# EasyEDA Pro project 通用采样.eprj, board CKSR15
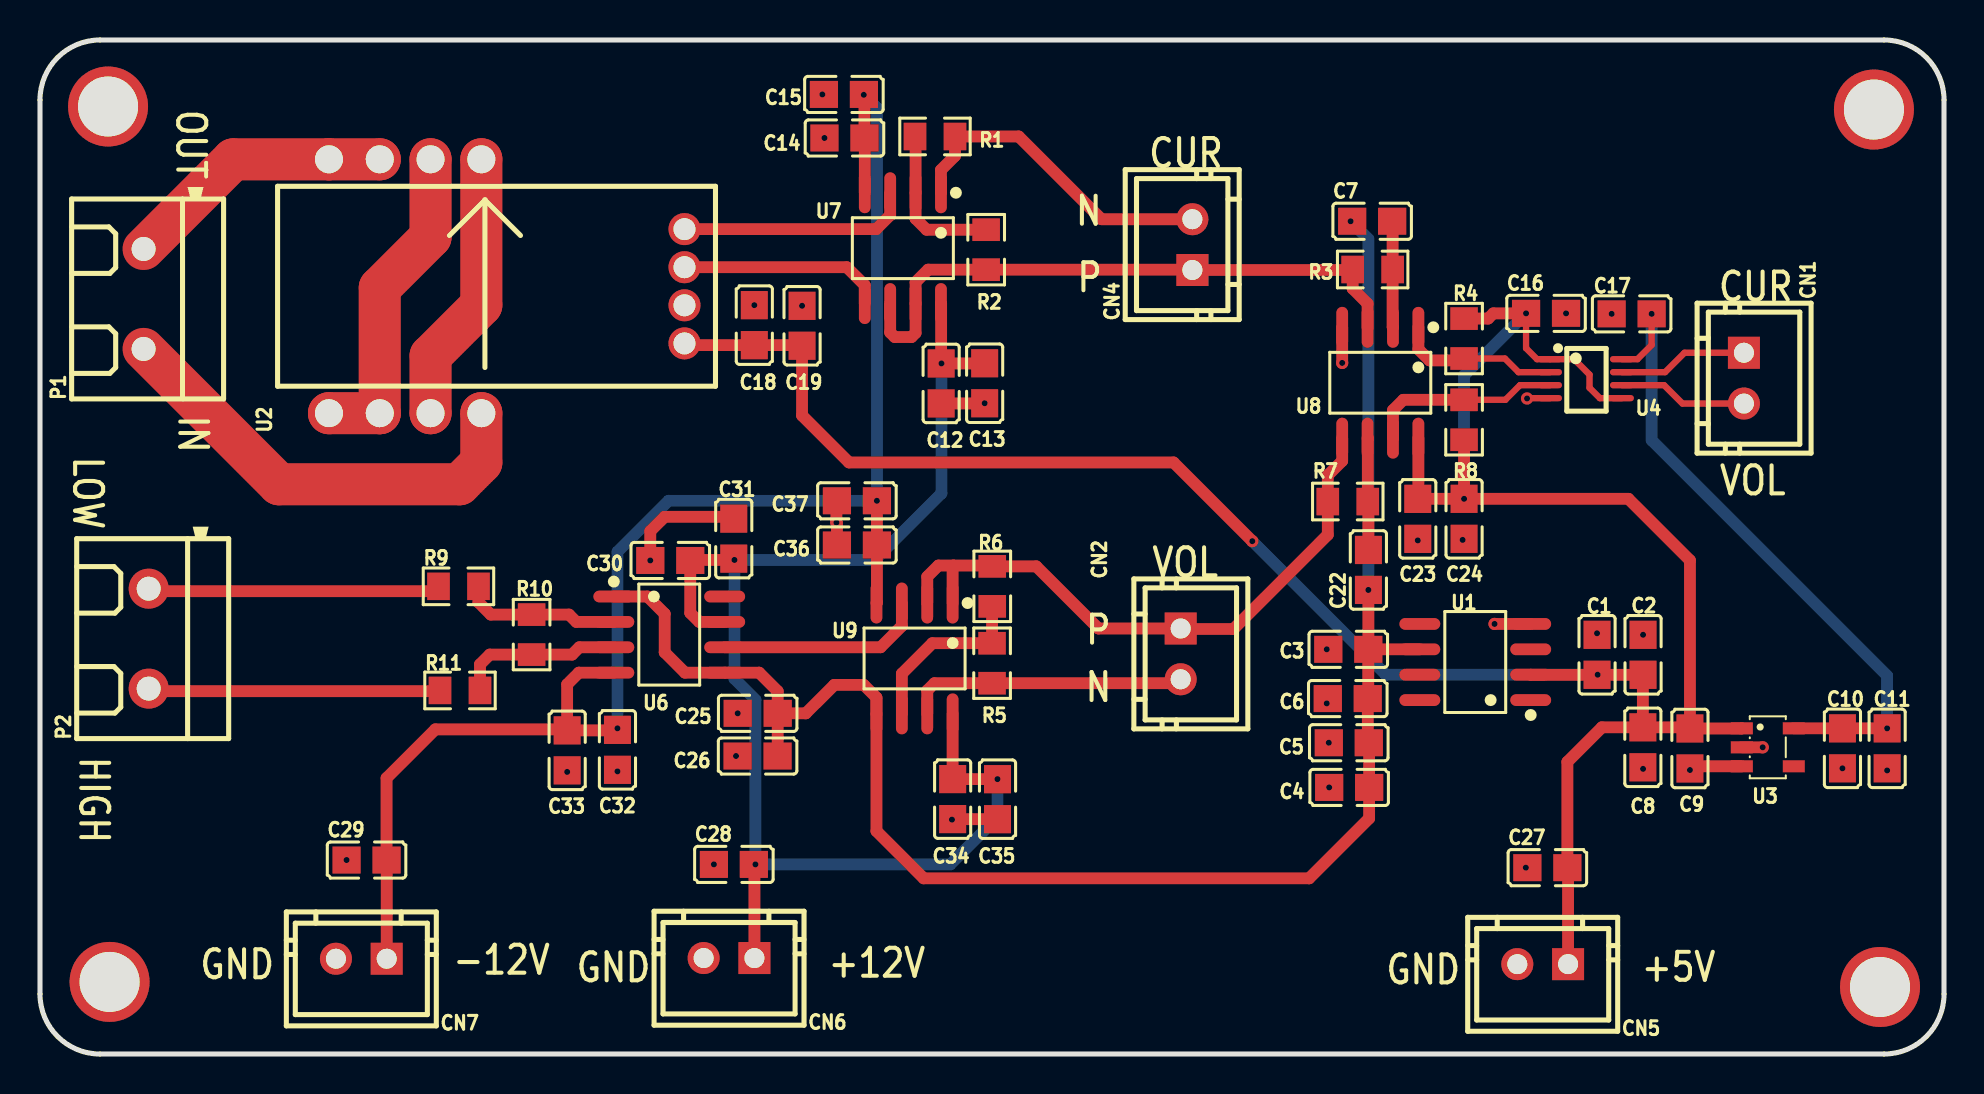
[diagram p6: board, top side]
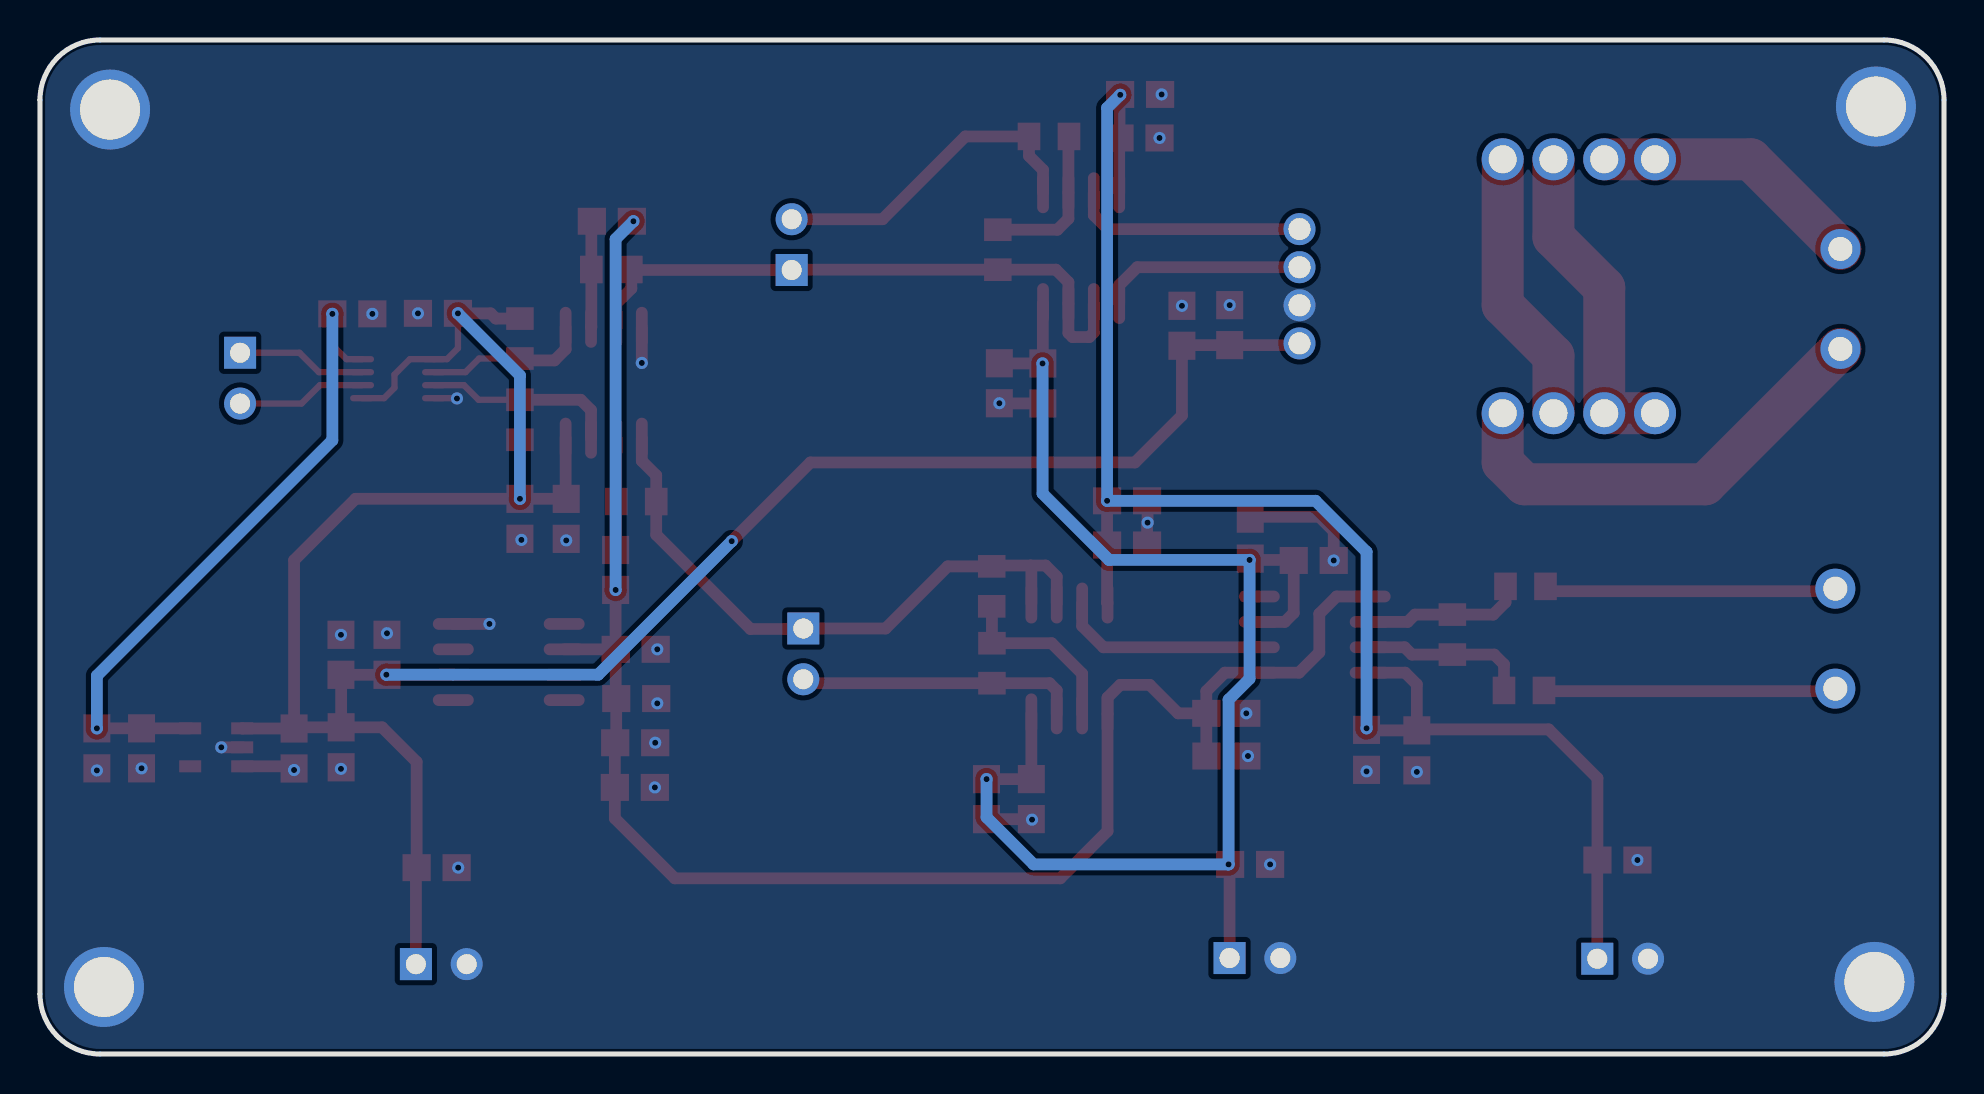
[diagram p7: board, bottom side, seen from below]

Outline 95.22 x 50.72 mm; copper layers: Top Layer, Bottom Layer. Coordinates in mm from the lower left corner of the outline.
Outline path: 0,47.72 0,3 arc(0.88,0.88) 3,0 92.22,0 arc(94.35,0.88) 95.22,3 95.22,47.72 arc(94.35,49.85) 92.22,50.72 3,50.72 arc(0.88,49.85) 0,47.72
Stack: Top Layer 0.035mm / Dielectric1 1.51mm FR4 er 4.5 / Bottom Layer 0.035mm

## Design rules (mm)
template: 自定义配置
spacing copperThickness1oz (default): track to track 0.102, other pairs 0.152 to 0.3
spacing copperThickness2oz: track to track 0.203, other pairs 0.152 to 0.3
track width copperThickness1oz (default): min 0.127, default 0.254, max 2.54
track width copperThickness2oz: min 0.203, default 0.254, max 2.54
differential pair differentialPair (default): width min 0.127, default 0.254, max 2.54; gap min 0.152, default 0.152
via viaSize (default): diameter min 0.5, default 0.61, max 10; hole min 0.3, default 0.305, max 6.3

## Placement (name value [footprint] x y rotation side)
C1  4.7uF  [C0805]  77.87 19.97 270 top
C2  100nF  [C0805]  80.17 19.97 270 top
C3  100nF  [C0805]  65.43 20.24 0 top
C4  4.7uF  [C0805]  65.47 13.34 0 top
C5  4.7uF  [C0805]  65.46 15.57 0 top
C6  4.7uF  [C0805]  65.41 17.78 0 top
C7  100nF  [C0805]  66.62 41.66 0 top
C8  1uF  [C0805]  80.16 15.34 270 top
C9  100nF  [C0805]  82.52 15.28 270 top
C10  1uF  [C0805]  90.14 15.29 270 top
C11  100nF  [C0805]  92.38 15.29 270 top
C12  100nF  [C0805]  45.07 33.54 90 top
C13  1uF  [C0805]  47.24 33.55 90 top
C14  100nF  [C0805]  40.23 45.82 0 top
C15  1uF  [C0805]  40.21 48 0 top
C16  100nF  [C0805]  75.32 37.05 0 top
C17  100nF  [C0805]  79.6 37.02 180 top
C18  100nF  [C0805]  35.72 36.46 270 top
C19  1uF  [C0805]  38.11 36.43 270 top
C22  100nF  [C0805]  66.44 24.21 90 top
C23  100nF  [C0805]  68.91 26.77 90 top
C24  1uF  [C0805]  71.22 26.77 90 top
C25  1uF  [C0805]  35.89 17.04 180 top
C26  1uF  [C0805]  35.89 14.91 180 top
C27  10uF  [C0805]  75.39 9.32 0 top
C28  10uF  [C0805]  34.7 9.49 0 top
C29  10uF  [C0805]  16.33 9.7 0 top
C30  100nF  [C0805]  31.52 24.69 0 top
C31  1uF  [C0805]  34.7 25.78 270 top
C32  100nF  [C0805]  28.88 15.22 90 top
C33  1uF  [C0805]  26.37 15.19 90 top
C34  100nF  [C0805]  45.64 12.75 90 top
C35  1uF  [C0805]  47.89 12.75 90 top
C36  100nF  [C0805]  40.86 25.46 0 top
C37  1uF  [C0805]  40.86 27.67 0 top
CN1  CON2-2.54*2P  [CONN-TH_2P-P2.54-V]  85.22 33.81 270 top
CN2  CON2-2.54*2P  [CONN-TH_2P-P2.54-V]  57.05 20.02 270 top
CN4  CON2-2.54*2P  [CONN-TH_2P-P2.54-V]  57.63 40.49 90 top
CN5  CON2-2.54*2P  [CONN-TH_2P-P2.54-V]  75.15 4.5 180 top
CN6  CON2-2.54*2P  [CONN-TH_2P-P2.54-V]  34.46 4.8 180 top
CN7  CON2-2.54*2P  [CONN-TH_2P-P2.54-V]  16.07 4.77 180 top
NOREF  -  [Pad_e787]  91.72 47.24 0 top
NOREF#2  -  [Pad_e786]  92.02 3.35 0 top
NOREF#3  -  [Pad_e785]  3.48 3.61 0 top
NOREF#4  -  [Pad_e783]  3.4 47.4 0 top
P1  KF301-2P接线端子  [CONN-TH_XY301V-A-5.0-2P]  5.18 37.77 90 top
P2  KF301-2P接线端子  [CONN-TH_XY301V-A-5.0-2P]  5.44 20.78 90 top
R1  10K  [R0805]  44.76 45.9 180 top
R2  10K  [R0805]  47.32 40.23 90 top
R3  10K  [R0805]  66.65 39.24 0 top
R4  10K  [R0805]  71.22 35.79 90 top
R5  10K  [R0805]  47.62 19.55 90 top
R6  10K  [R0805]  47.62 23.39 270 top
R7  10K  [R0805]  65.41 27.64 0 top
R8  10K  [R0805]  71.22 31.72 270 top
R9  10K  [R0805]  20.93 23.39 180 top
R10  10K  [R0805]  24.59 20.98 90 top
R11  10K  [R0805]  21.01 18.19 0 top
U1  REF5025AIDR  [SOIC-8_L4.9-W3.9-P1.27-LS6.0-BL]  71.78 19.61 90 top
U2  CKSR6-NP  [SENSOR-TH_CKSR6-NP]  23.34 38.41 90 top
U3  TLV75533PDBVR  [SOT-23-5_L3.0-W1.7-P0.95-LS2.8-BR]  86.41 15.34 180 top
U4  SN74LVC2T45DCTR  [SM8_L3.2-W2.9-P0.65-LS4.3-BR]  77.32 33.78 180 top
U6  INA149AID  [SOIC-8_L4.9-W3.9-P1.27-LS6.0-BL]  31.47 20.98 270 top
U7  OPA2192IDR  [SOIC-8_L4.9-W3.9-P1.27-LS6.0-BL]  43.15 40.31 180 top
U8  TLV3202AIDR  [SOIC-8_L4.9-W3.9-P1.27-LS6.0-BL]  67.03 33.58 180 top
U9  OPA2192IDR  [SOIC-8_L4.9-W3.9-P1.27-LS6.0-BL]  43.74 19.79 180 top

## Footprints (pads in the part's own frame, mm; a bottom-side part is the same pattern mirrored in y, then rotated)
C0805
  rect 1.41x1.35 smd: 1(-1,0) 2(1,0)
CONN-TH_2P-P2.54-V
  rect 1.6x1.6 hole 1: 1(-1.27,0)
  round 1.6 hole 1: 2(1.27,0)
CONN-TH_XY301V-A-5.0-2P
  round 2 hole 1.2: 1(-2.5,0) 2(2.5,0)
Pad_e783
  round 4 hole 3: 1(0,0)
Pad_e785
  round 4 hole 3: 1(0,0)
Pad_e786
  round 4 hole 3: 1(0,0)
Pad_e787
  round 4 hole 3: 1(0,0)
R0805
  rect 1.133x1.377 smd: 1(-1,0) 2(1,0)
SENSOR-TH_CKSR6-NP
  round 2.1 hole 1.4: 2(-6.35,1.27) 3(-6.35,3.81) 4(-6.35,6.35) 5(-6.35,8.89) 6(6.35,8.89) 7(6.35,6.35) 8(6.35,3.81) 9(6.35,1.27)
  round 1.6 hole 1.1: 11(2.858,-8.89) 12(0.953,-8.89) 13(-0.953,-8.89) 14(-2.858,-8.89)
SM8_L3.2-W2.9-P0.65-LS4.3-BR
  oval 1.198x0.315 smd: 1(1.799,-0.975) 2(1.799,-0.325) 3(1.799,0.325) 4(1.799,0.975) 5(-1.799,0.975) 6(-1.799,0.325) 7(-1.799,-0.325) 8(-1.799,-0.975)
SOIC-8_L4.9-W3.9-P1.27-LS6.0-BL
  oval 0.588x2.045 smd: 1(-1.905,-2.772) 2(-0.635,-2.772) 3(0.635,-2.772) 4(1.905,-2.772) 5(1.905,2.772) 6(0.635,2.772) 7(-0.635,2.772) 8(-1.905,2.772)
SOT-23-5_L3.0-W1.7-P0.95-LS2.8-BR
  rect 1.1x0.6 smd: 1(1.3,-0.95) 2(1.3,0) 3(1.3,0.95) 4(-1.3,0.95) 5(-1.3,-0.95)

## Nets
As in the schematic, except:
GND: C1.1 C2.1 C3.1 C4.1 C5.1 C6.1 C8.2 C9.2 C10.2 C11.2 C12.1 C13.1 C14.1 C15.1 C16.2 C17.2 C18.1 C19.1 C23.1 C24.1 C25.2 C26.2 C27.1 C28.1 C29.1 C30.1 C31.1 C32.1 C33.1 C34.1 C35.1 C36.1 C37.1 CN5.2 CN6.2 CN7.2 NOREF.1 NOREF#2.1 NOREF#3.1 NOREF#4.1 U1.4 U2.13 U3.2 U3.3 U4.4 U8.4

Pads without a net: U1 1 3 5 7 8; U3 4; U6 8

## Via types
v1: diameter 0.61, hole 0.305, Top Layer to Bottom Layer, 48 vias

## Routing (per net, layer and track width the routed paths; a pad name or vN(x,y) marks a point on that pad's centre or on a via; arc(x,y) is an arc through that point)
3.3V: length 33.6
  Top Layer w0.315: U4.8 79.89,34.76 80.6,35.47 v1(80.6,37.02)
  Top Layer w0.588: U3.5 90.14,16.29 ; C10.1 v1(92.38,16.29)
  Bottom Layer w0.588: v1(92.38,16.29) 92.38,18.92 80.6,30.7 v1(80.6,37.02)
+2.5V: length 86.7
  Top Layer w0.588: C25.1 38.3,17.04 39.73,18.47 41.2,18.47 41.83,17.83 U9.5 41.83,11.15 44.2,8.79 63.47,8.79 66.47,11.79 C4.2 66.47,15.55 C5.2 66.41,15.62 C6.2 66.43,17.81 C3.2 ; C25.1 36.89,18.15 35.97,19.08 U6.5 32.26,19.08 31.24,20.09 31.24,22.02 30.38,22.89 U6.1 ; C25.1 36.89,14.91 C26.1 ; C3.2 66.44,20.25 v1(66.44,23.21) ; C3.2 U1.6
  Bottom Layer w0.588: v1(66.44,23.21) 66.44,40.77 v1(65.55,41.66)
+5V: length 133.4
  Top Layer w0.315: U4.5 78.01,32.81 77.5,33.33 77.5,33.99 76.72,34.76 U4.1 74.87,34.76 74.32,35.31 v1(74.32,37.05)
  Top Layer w0.588: C8.1 78.11,16.34 76.39,14.61 C27.2 76.42,9.29 CN5.1 ; C8.1 82.46,16.34 C9.1 ; C8.1 80.16,18.96 C2.2 C1.2 74.56,18.97 U1.2 ; U3.1 85.1,16.28 C9.1 ; v1(71.22,27.77) 79.44,27.77 82.52,24.7 C9.1 ; v1(71.22,27.77) R8.2 ; v1(71.22,27.77) 68.96,27.77 68.94,27.8 ; 68.94,27.8 U8.8 ; 68.94,27.8 C23.2 ; R4.2 72.42,36.79 72.69,37.05 v1(74.32,37.05) ; 32.23,35.55 32.32,35.46 C18.2 38.08,35.46 38.11,35.43 38.11,31.94 40.46,29.59 56.69,29.59 v1(60.63,25.65)
  Bottom Layer w0.588: v1(60.63,25.65) 67.31,18.97 v1(77.9,18.97) ; v1(74.32,37.05) 71.22,33.95 v1(71.22,27.77)
+12V: length 71
  Top Layer w0.588: U9.8 C34.2 v1(47.88,13.75) C35.2 ; C13.2 47.23,34.54 C12.2 45.07,37.53 U7.8 ; U6.7 32.97,21.62 32.52,22.06 C30.2 32.55,24.71 v1(34.73,24.71) ; C28.2 35.73,9.46 CN6.1
  Bottom Layer w0.588: v1(47.88,13.75) 47.88,11.84 45.53,9.49 v1(35.78,9.49) 35.78,17.72 34.73,18.77 v1(34.73,24.71) 41.76,24.71 45.09,28.04 v1(45.09,34.54)
-12V: length 80
  Top Layer w0.588: U7.4 41.25,45.81 C14.2 41.23,47.95 v1(41.2,47.98) ; C33.2 26.37,18.49 26.95,19.08 U6.4 ; C33.2 26.31,16.24 19.77,16.24 17.33,13.8 C29.2 17.34,9.69 CN7.1 ; C33.2 28.85,16.19 C32.2 ; v1(41.86,27.67) C36.2 41.86,22.58 U9.4
  Bottom Layer w0.588: v1(41.2,47.98) 41.86,47.32 v1(41.86,27.67) 31.43,27.67 28.88,25.12 v1(28.88,16.29)
GND: length 21.1
  Top Layer w0.315: U4.4 74.39,32.81 v1(74.37,32.79)
  Top Layer w0.588: C9.2 82.63,14.39 U3.3 ; C35.1 45.65,11.75 C34.1 ; C37.1 39.83,27.65 v1(39.83,26.58) 39.86,26.56 C36.1 ; U3.2 v1(86.16,15.34) ; v1(30.52,24.69) 30.52,26.15 31.24,26.87 34.6,26.87 C31.1 ; U8.4 v1(65.13,34.57) ; C12.1 47.23,32.54 v1(47.24,32.55) ; U1.4 v1(72.75,21.51)
  vias: v1(15.33,9.7) v1(26.37,14.11) v1(28.88,14.14) v1(33.7,9.49) v1(34.81,14.91) v1(34.89,17.04) v1(35.72,37.46) v1(38.11,37.43) v1(39.13,48) v1(39.23,45.82) v1(45.61,11.72) v1(64.35,20.24) v1(64.35,17.54) v1(64.46,15.57) v1(64.47,13.34) v1(68.91,25.69) v1(71.15,25.72) v1(74.31,9.32) v1(76.32,37.05) v1(77.87,21.05) v1(78.6,37.02) v1(80.17,20.97) v1(80.17,14.26) v1(82.52,14.21) v1(90.14,14.29) v1(92.38,14.19)
CUR_3V: length 6.5
  Top Layer w0.315: U4.7 81.28,34.11 82.25,35.08 CN1.1
CUR_5V: length 8.2
  Top Layer w0.315: R4.1 73.26,34.79 73.94,34.11 U4.2
  Top Layer w0.588: U8.1 68.94,35.26 69.49,34.7 71.13,34.7 R4.1
CUR_IN: length 22.6
  Top Layer w2.1: P1.1 11.95,28.5 20.98,28.5 22.07,29.59 U2.2
CUR_N: length 16.7
  Top Layer w0.588: U7.1 45.06,44.22 45.76,44.92 R1.1 48.95,45.9 53.09,41.76 CN4.2
CUR_OUT: length 13.7
  Top Layer w2.1: U2.7 U2.6 9.67,44.75 P1.2
CUR_P: length 30.8
  Top Layer w0.588: U8.3 66.4,37.54 65.65,38.29 R3.1 65.62,39.22 CN4.1 57.62,39.23 R2.1 44.42,39.23 43.79,38.61 U7.7 43.79,36.07 43.59,35.86 42.75,35.86 42.52,36.09 U7.6
VOL_3V: length 6.5
  Top Layer w0.315: U4.6 81.22,33.46 82.14,32.54 CN1.2
VOL_5V: length 9.8
  Top Layer w0.315: U4.3 74.02,33.46 73.29,32.72 R8.1
  Top Layer w0.588: R8.1 68.18,32.72 67.67,32.21 U8.7
VOL_H: length 14.6
  Top Layer w0.588: P2.1 5.56,18.15 19.97,18.15 R11.1
VOL_L: length 14.6
  Top Layer w0.588: P2.2 5.56,23.15 19.69,23.15 R9.2
VOL_N: length 14.1
  Top Layer w0.588: U9.7 44.37,18.19 44.74,18.55 R5.1 56.85,18.55 CN2.2
VOL_P: length 31.9
  Top Layer w0.588: 45.68,24.44 45.64,24.4 U9.1 ; 45.68,24.44 44.93,24.44 44.37,23.88 U9.2 ; 45.68,24.44 47.58,24.44 R6.1 49.83,24.39 52.93,21.29 CN2.1 57.07,21.26 59.69,21.26 64.41,25.97 R7.1 64.41,28.95 65.13,29.67 U8.5
$1N3362: length 8
  Top Layer w0.588: U6.2 26.82,21.62 26.46,21.98 R10.2 22.55,21.98 21.93,22.6 R9.1
$1N3363: length 8.4
  Top Layer w0.588: R11.2 22.01,19.49 22.5,19.98 R10.1 26.61,19.98 26.97,20.35 U6.3
$1N3370: length 10.4
  Top Layer w0.588: U6.6 42.04,20.35 43.1,21.41 U9.3
$1N3373: length 9
  Top Layer w0.588: R6.2 47.62,22.38 R5.2 44.63,20.55 43.1,19.03 U9.6
$1N3378: length 10.3
  Top Layer w0.588: U7.5 41.25,38.46 40.35,39.36 32.23,39.36
$1N3381: length 7.9
  Top Layer w0.588: R2.2 44.34,41.23 43.79,41.78 U7.2 43.79,45.87 R1.2
$1N3382: length 11.7
  Top Layer w0.588: U7.3 42.52,41.96 41.82,41.26 32.23,41.26
$1N3389: length 5.6
  Top Layer w0.588: U8.6 66.41,30.8 R7.2 66.44,27.61 C22.2
$1N3392: length 5.3
  Top Layer w0.588: C7.2 67.65,41.63 R3.2 67.65,36.37 U8.2
$1N3695: length 13.8
  Top Layer w2.1: 19.53,32.06 19.53,34.92 22.07,37.47 U2.9
$1N3709: length 16.3
  Top Layer w2.1: U2.5 U2.4 16.99,38.33 19.53,40.87 19.53,44.75

## Copper pours and planes (outline as drawn; the poured copper is in the pictures)
GND on Bottom Layer: -0.36,51.05 95.53,51.05 95.53,-0.36 -0.36,-0.36

## Text on the board
Top Silkscreen Layer: GND | -12V | +12V | N | P | CUR | VOL | +5V | LOW | HIGH | OUT | IN
